# Altium schematic sheet power.SchDoc
size A
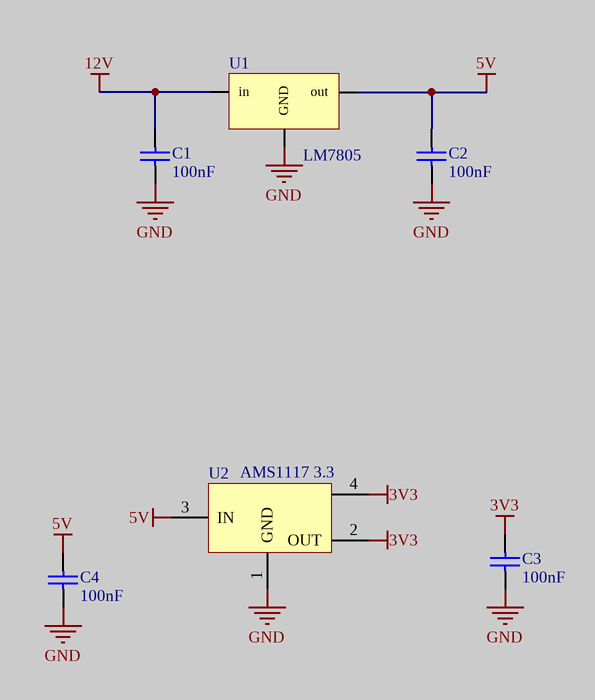
[diagram p0: power.SchDoc]

## Parts
C1  100nF  [CAPC0603]
C2  100nF  [CAPC0603]
C3  100nF  [CAPC0603]
C4  100nF  [CAPC0603]
U1  LM7805  [D2PAK]
U2  AMS1117 3.3  [AMS1117]

## Nets
3V3: C3.2 U2.2(OUT) U2.4
5V: C2.2 C4.2 U1.3(out) U2.3(IN)
12V: C1.2 U1.1(in)
GND: C1.1 C2.1 C3.1 C4.1 U1.2(GND) U2.1(GND)

## Library data of the parts
C1-C4 = Capacitor: Published: 8-Jun-2000; LatestRevisionDate: 17-Jul-2002; LatestRevisionNote: Re-released for DXP Platform.; PackageReference: C0805; Publisher: Altium Limited; Value: 100nF
U1 = LM7805: IC REG LIN 5V 1A
U2 = AMS1117